# Altium project analogtestboard.PRJPCB
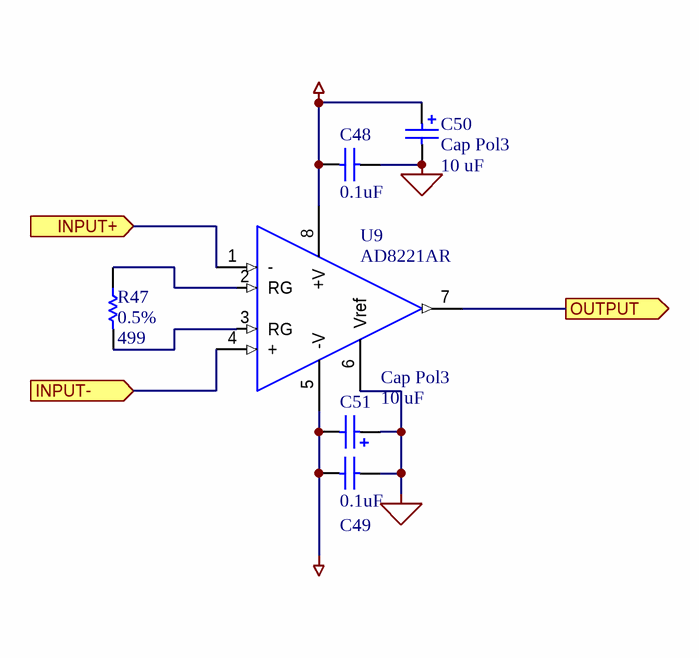
[diagram p0: input.SCHDOC]
4 sheets, 80 parts. Net scope: hierarchical (ports join the sheet entries above them; power ports are global).
Board file: analogtestboard.PCBDOC
Sheets:
  input.SCHDOC
  PGA.SCHDOC
  aa8028.SCHDOC
  AA8513.SCHDOC

## Sheet input.SCHDOC
size B

### Parts
C48  value 0.1uF  [CC1608-0603]  (hidden comment: Cap)
C49  value 0.1uF  [CC1608-0603]  (hidden comment: Cap)
C50  Cap Pol3  value 10 uF  [TC3216-1206]
C51  Cap Pol3  value 10 uF  [TC3216-1206]
R47  0.5%  value 499  [R2012-0805]
U9  AD8221AR  [SO-G8]

### Ports
INPUT+ (in), INPUT- (in), OUTPUT (out)

### Nets
AVDD: C48.1 C50.1 U9.8(+V)
AVSS: C49.1 C51.2 U9.5(-V)
GND: C48.2 C49.2 C50.2 C51.1 U9.6(Vref)
NetR47_1: R47.1 U9.2(RG)
NetR47_2: R47.2 U9.3(RG)
NetU9_1: U9.1(-) ; port INPUT+
NetU9_4: U9.4(+) ; port INPUT-
NetU9_7: U9.7(Vout) ; port OUTPUT

### Library data of the parts
C48 C49 = Cap: Capacitor; Manufacturer: Generic Components; Class I: Passive; Published: 8-Jun-2000; Revision: July-2002: Re-released for DXP Platform.; Publisher: Altium Limited; Class II: Capacitor
C50 C51 = Cap Pol3: Polarized Capacitor (Surface Mount); Manufacturer: Generic Components; Class I: Passive; Published: 8-Jun-2000; Revision: July-2002: Re-released for DXP Platform.; Publisher: Altium Limited; Class II: Capacitor
R47 = Res1: RR1220P-4990-D-M; Manufacturer: Generic Components; Class I: Passive; Class II: Resistor; Published: 8-Jun-2000; Revision: July-2002: Re-released for DXP Platform.; Publisher: Altium Limited
U9 = AD8221: AD8221 Precision Instrumentation Amplifier

## Sheet PGA.SCHDOC
size B
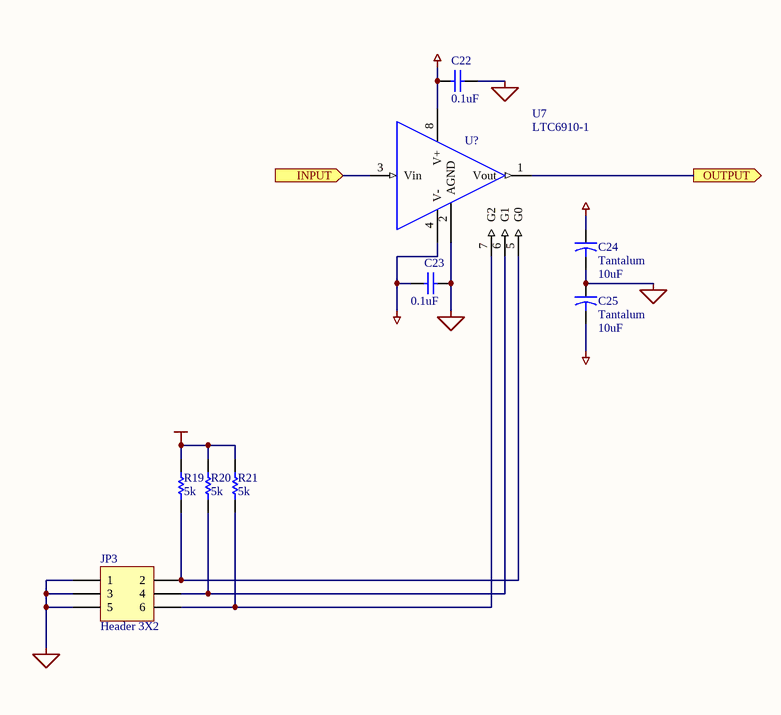
[diagram p1: PGA.SCHDOC]

### Parts
(Parts that share a designator on the sheet are numbered #1, #2 ... from top to bottom, then left to right.)
C22  value 0.1uF  [CC1608-0603]  (hidden comment: Cap)
C23  value 0.1uF  [CC1608-0603]  (hidden comment: Cap)
C24  Tantalum  value 10uF  [TC3216-1206]
C25  Tantalum  value 10uF  [TC3216-1206]
JP3#1  Header 3X2  [HDR2X3]
R19  value 5k  [CC2012-0805]  (hidden comment: Res1)
R20  value 5k  [CC2012-0805]  (hidden comment: Res1)
R21  value 5k  [CC2012-0805]  (hidden comment: Res1)
U7  LTC6910-1  [TSOT-23-8]

### Ports
INPUT (in), OUTPUT (out)

### Nets
AVDD: C22.1 C24.1 R19.2 R20.2 R21.2 U7.8(V+)
AVSS: C23.2 C25.2 U7.4(V-)
GND: C22.2 C23.1 C24.2 C25.1 JP3#1.1 JP3#1.3 JP3#1.5 U7.2(AGND)
NetJP3#1_2: JP3#1.2 R19.1 U7.5(G0)
NetJP3#1_4: JP3#1.4 R20.1 U7.6(G1)
NetJP3#1_6: JP3#1.6 R21.1 U7.7(G2)
NetU7_1: U7.1(Vout) ; port OUTPUT
NetU7_3: U7.3(Vin) ; port INPUT

### Notes on the sheet
- (in symbol LTC6910-2) U?

### Library data of the parts
C22 C23 = Cap: as C48 on sheet input; Published: 8-Jun-2000; Revision: July-2002: Re-released for DXP Platform.; Publisher: Altium Limited; Class II: Capacitor
C24 C25 = Cap2: Capacitor; Manufacturer: Generic Components; Class I: Passive; Published: 23-Sep-2002; Publisher: Altium Limited; Class II: Capacitor
JP3#1 = Header 3X2: Header, 3-Pin, Dual row; Manufacturer: Generic Components; Class I: Connector; Revision: July-2002: Re-released for DXP Platform.; Publisher: Altium Limited
R19-R21 = Res1: Resistor; Manufacturer: Generic Components; Class I: Passive; Published: 8-Jun-2000; Revision: July-2002: Re-released for DXP Platform.; Publisher: Altium Limited; Class II: Resistor
U7 = LTC6910-2: LTI Digitally Controlled Programmabe Gain Amp

## Sheet aa8028.SCHDOC
size B
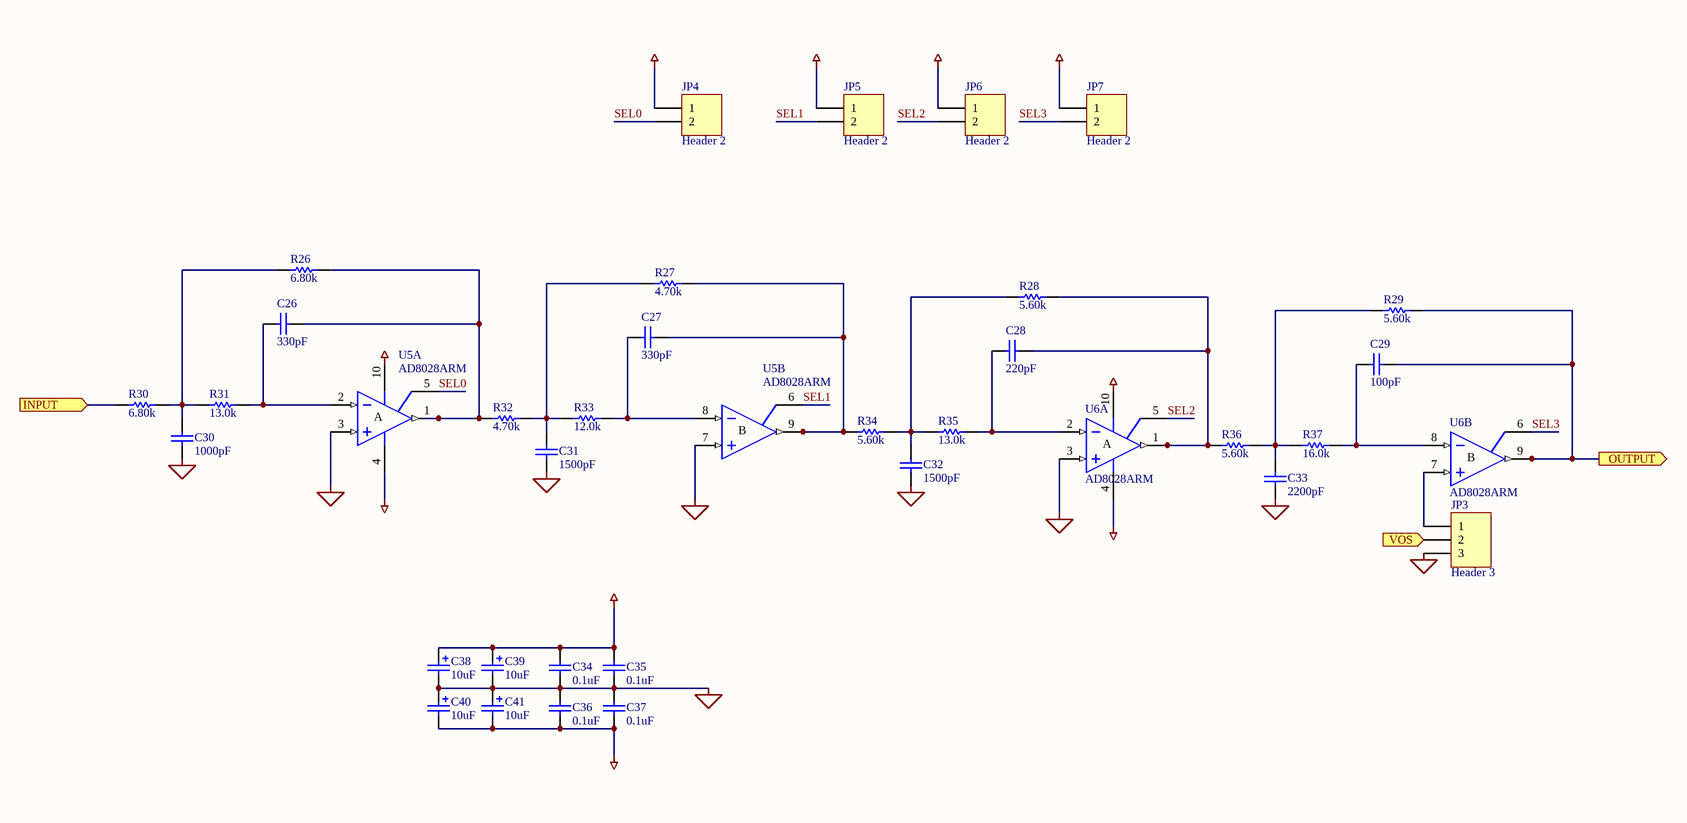
[diagram p2: aa8028.SCHDOC]

### Parts
(Parts that share a designator on the sheet are numbered #1, #2 ... from top to bottom, then left to right.)
C26  value 330pF  [CC3216-1206]  (hidden comment: Cap)
C27  value 330pF  [CC3216-1206]  (hidden comment: Cap)
C28  value 220pF  [CC3216-1206]  (hidden comment: Cap)
C29  value 100pF  [CC3216-1206]  (hidden comment: Cap)
C30  value 1000pF  [CC3216-1206]  (hidden comment: Cap)
C31  value 1500pF  [CC3216-1206]  (hidden comment: Cap)
C32  value 1500pF  [CC3216-1206]  (hidden comment: Cap)
C33  value 2200pF  [CC3216-1206]  (hidden comment: Cap)
C34  value 0.1uF  [CC1608-0603]  (hidden comment: Cap)
C35  value 0.1uF  [CC1608-0603]  (hidden comment: Cap)
C36  value 0.1uF  [CC1608-0603]  (hidden comment: Cap)
C37  value 0.1uF  [CC1608-0603]  (hidden comment: Cap)
C38  value 10uF  [TC7360-2924]  (hidden comment: Cap Pol1)
C39  value 10uF  [TC7360-2924]  (hidden comment: Cap Pol1)
C40  value 10uF  [TC7360-2924]  (hidden comment: Cap Pol1)
C41  value 10uF  [TC7360-2924]  (hidden comment: Cap Pol1)
JP3#2  Header 3  [HDR1X3]
JP4  Header 2  [HDR1X2]
JP5  Header 2  [HDR1X2]
JP6  Header 2  [HDR1X2]
JP7  Header 2  [HDR1X2]
R26  value 6.80k  [CC2012-0805]  (hidden comment: Res1)
R27  value 4.70k  [CC2012-0805]  (hidden comment: Res1)
R28  value 5.60k  [CC2012-0805]  (hidden comment: Res1)
R29  value 5.60k  [CC2012-0805]  (hidden comment: Res1)
R30  value 6.80k  [CC2012-0805]  (hidden comment: Res1)
R31  value 13.0k  [CC2012-0805]  (hidden comment: Res1)
R32  value 4.70k  [CC2012-0805]  (hidden comment: Res1)
R33  value 12.0k  [CC2012-0805]  (hidden comment: Res1)
R34  value 5.60k  [CC2012-0805]  (hidden comment: Res1)
R35  value 13.0k  [CC2012-0805]  (hidden comment: Res1)
R36  value 5.60k  [CC2012-0805]  (hidden comment: Res1)
R37  value 16.0k  [CC2012-0805]  (hidden comment: Res1)
U5  AD8028ARM  [TSSO3x5-G10]  (parts A,B of 2)
U6  AD8028ARM  [TSSO3x5-G10]  (parts A,B of 2)

### Ports
INPUT (in), OUTPUT (out), VOS (in)

### Nets
AVDD: C34.2 C35.2 C38.1 C39.1 JP4.1 JP5.1 JP6.1 JP7.1 U5.10(V+) U6.10(V+)
AVSS: C36.1 C37.1 C40.2 C41.2 U5.4(V-) U6.4(V-)
GND: C30.1 C31.1 C32.1 C33.1 C34.1 C35.1 C36.2 C37.2 C38.2 C39.2 C40.1 C41.1 JP3#2.3 U5.3(IN+A) U5.7(IN+B) U6.3(IN+A)
SEL0: JP4.2 U5.5(SELA)
SEL1: JP5.2 U5.6(SELB)
SEL2: JP6.2 U6.5(SELA)
SEL3: JP7.2 U6.6(SELB)
NetC26_1: C26.1 R26.1 R32.1 U5.1(VOUTA)
NetC26_2: C26.2 R31.2 U5.2(IN-A)
NetC27_1: C27.1 R27.1 R34.1 U5.9(VOUTB)
NetC27_2: C27.2 R33.2 U5.8(IN-B)
NetC28_1: C28.1 R28.1 R36.1 U6.1(VOUTA)
NetC28_2: C28.2 R35.2 U6.2(IN-A)
NetC29_1: C29.1 R29.1 U6.9(VOUTB) ; port OUTPUT
NetC29_2: C29.2 R37.2 U6.8(IN-B)
NetC30_2: C30.2 R26.2 R30.2 R31.1
NetC31_2: C31.2 R27.2 R32.2 R33.1
NetC32_2: C32.2 R28.2 R34.2 R35.1
NetC33_2: C33.2 R29.2 R36.2 R37.1
NetJP3#2_1: JP3#2.1 U6.7(IN+B)
NetJP3#2_2: JP3#2.2 ; port VOS
NetR30_1: R30.1 ; port INPUT

### Notes on the sheet
- (in symbol AD8028ARM, part A) A
- (in symbol AD8028ARM, part B) B

### Library data of the parts
C26-C37 = Cap: as C48 on sheet input; Published: 8-Jun-2000; Revision: July-2002: Re-released for DXP Platform.; Publisher: Altium Limited; Class II: Capacitor
C38-C41 = Cap Pol1: Polarized Capacitor (Radial); Manufacturer: Generic Components; Class I: Passive; Published: 8-Jun-2000; Revision: July-2002: Re-released for DXP Platform.; Publisher: Altium Limited; Class II: Capacitor
JP3#2 = Header 3: Header, 3-Pin; Manufacturer: Generic Components; Class I: Connector; Revision: July-2002: Re-released for DXP Platform.; Publisher: Altium Limited
JP4-JP7 = Header 2: Header, 2-Pin; Manufacturer: Generic Components; Class I: Connector; Revision: July-2002: Re-released for DXP Platform.; Publisher: Altium Limited
R26-R37 = Res1: as R19 on sheet PGA; Published: 8-Jun-2000; Revision: July-2002: Re-released for DXP Platform.; Publisher: Altium Limited; Class II: Resistor
U5 U6 = AD8028ARM: Analog Devices Low Distortion, High Speed RRIO OA

## Sheet AA8513.SCHDOC
size B
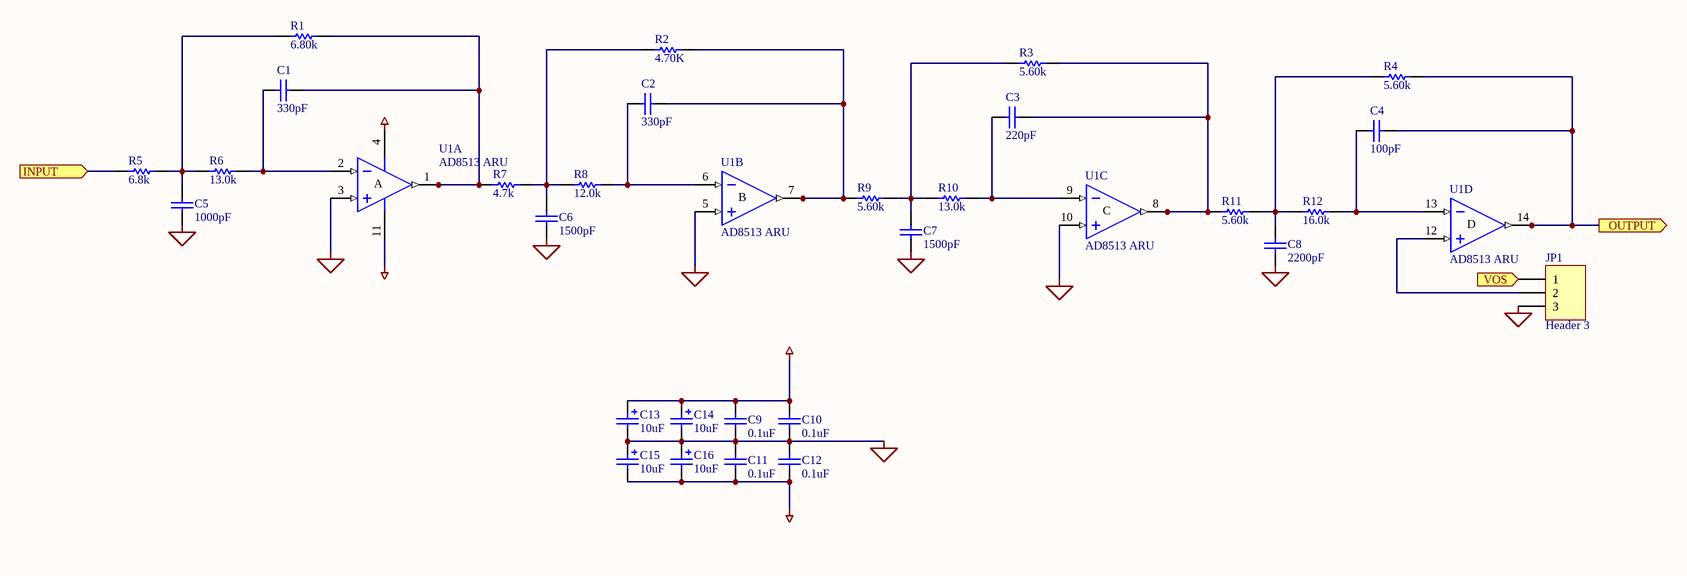
[diagram p3: AA8513.SCHDOC]

### Parts
C1  value 330pF  [CC3216-1206]  (hidden comment: Cap)
C2  value 330pF  [CC3216-1206]  (hidden comment: Cap)
C3  value 220pF  [CC3216-1206]  (hidden comment: Cap)
C4  value 100pF  [CC3216-1206]  (hidden comment: Cap)
C5  value 1000pF  [CC3216-1206]  (hidden comment: Cap)
C6  value 1500pF  [CC3216-1206]  (hidden comment: Cap)
C7  value 1500pF  [CC3216-1206]  (hidden comment: Cap)
C8  value 2200pF  [CC3216-1206]  (hidden comment: Cap)
C9  value 0.1uF  [CC1608-0603]  (hidden comment: Cap)
C10  value 0.1uF  [CC1608-0603]  (hidden comment: Cap)
C11  value 0.1uF  [CC1608-0603]  (hidden comment: Cap)
C12  value 0.1uF  [CC1608-0603]  (hidden comment: Cap)
C13  value 10uF  [TC7360-2924]  (hidden comment: Cap Pol1)
C14  value 10uF  [TC7360-2924]  (hidden comment: Cap Pol1)
C15  value 10uF  [TC7360-2924]  (hidden comment: Cap Pol1)
C16  value 10uF  [TC7360-2924]  (hidden comment: Cap Pol1)
JP1  Header 3  [HDR1X3]
R1  value 6.80k  [CC2012-0805]  (hidden comment: Res1)
R2  value 4.70K  [CC2012-0805]  (hidden comment: Res1)
R3  value 5.60k  [CC2012-0805]  (hidden comment: Res1)
R4  value 5.60k  [CC2012-0805]  (hidden comment: Res1)
R5  value 6.8k  [CC2012-0805]  (hidden comment: Res1)
R6  value 13.0k  [CC2012-0805]  (hidden comment: Res1)
R7  value 4.7k  [CC2012-0805]  (hidden comment: Res1)
R8  value 12.0k  [CC2012-0805]  (hidden comment: Res1)
R9  value 5.60k  [CC2012-0805]  (hidden comment: Res1)
R10  value 13.0k  [CC2012-0805]  (hidden comment: Res1)
R11  value 5.60k  [CC2012-0805]  (hidden comment: Res1)
R12  value 16.0k  [CC2012-0805]  (hidden comment: Res1)
U1  AD8513 ARU  [TSSO5X6-G14/X.3]  (parts A,B,C,D of 4)

### Ports
INPUT (in), OUTPUT (out), VOS (in)

### Nets
AVDD: C9.2 C10.2 C13.1 C14.1 U1.4(V+)
AVSS: C11.1 C12.1 C15.2 C16.2 U1.11(V-)
GND: C5.1 C6.1 C7.1 C8.1 C9.1 C10.1 C11.2 C12.2 C13.2 C14.2 C15.1 C16.1 JP1.3 U1.3(IN+A) U1.5(IN+B) U1.10(IN+C)
NetC1_1: C1.1 R1.1 R7.1 U1.1(OUTA)
NetC1_2: C1.2 R6.2 U1.2(IN-A)
NetC2_1: C2.1 R2.1 R9.1 U1.7(OUTB)
NetC2_2: C2.2 R8.2 U1.6(IN-B)
NetC3_1: C3.1 R3.1 R11.1 U1.8(OUTC)
NetC3_2: C3.2 R10.2 U1.9(IN-C)
NetC4_1: C4.1 R4.1 U1.14(OUTD) ; port OUTPUT
NetC4_2: C4.2 R12.2 U1.13(IN-D)
NetC5_2: C5.2 R1.2 R5.2 R6.1
NetC6_2: C6.2 R2.2 R7.2 R8.1
NetC7_2: C7.2 R3.2 R9.2 R10.1
NetC8_2: C8.2 R4.2 R11.2 R12.1
NetJP1_1: JP1.1 ; port VOS
NetJP1_2: JP1.2 U1.12(IN+D)
NetR5_1: R5.1 ; port INPUT

### Notes on the sheet
- (in symbol AD8513ARU, part A) A
- (in symbol AD8513ARU, part B) B
- (in symbol AD8513ARU, part C) C
- (in symbol AD8513ARU, part D) D

### Library data of the parts
C1-C12 = Cap: as C48 on sheet input; Published: 8-Jun-2000; Revision: July-2002: Re-released for DXP Platform.; Publisher: Altium Limited; Class II: Capacitor
C13-C16 = Cap Pol1: as C38 on sheet aa8028; Published: 8-Jun-2000; Revision: July-2002: Re-released for DXP Platform.; Publisher: Altium Limited; Class II: Capacitor
JP1 = Header 3: as JP3#2 on sheet aa8028; Revision: July-2002: Re-released for DXP Platform.; Publisher: Altium Limited
R1-R12 = Res1: as R19 on sheet PGA; Published: 8-Jun-2000; Revision: July-2002: Re-released for DXP Platform.; Publisher: Altium Limited; Class II: Resistor
U1 = AD8513ARU: low-noise JFET quad OA

## Nets that join several sheets
AVDD: input (C48.1 C50.1 U9.8), PGA (6 pins), aa8028 (10 pins), AA8513 (5 pins)
AVSS: input (C49.1 C51.2 U9.5), PGA (C23.2 C25.2 U7.4), aa8028 (6 pins), AA8513 (5 pins)
GND: input (5 pins), PGA (8 pins), aa8028 (16 pins), AA8513 (16 pins)